# EAGLE board RF08ind (EAGLE 6.6.0), part 1 of 3
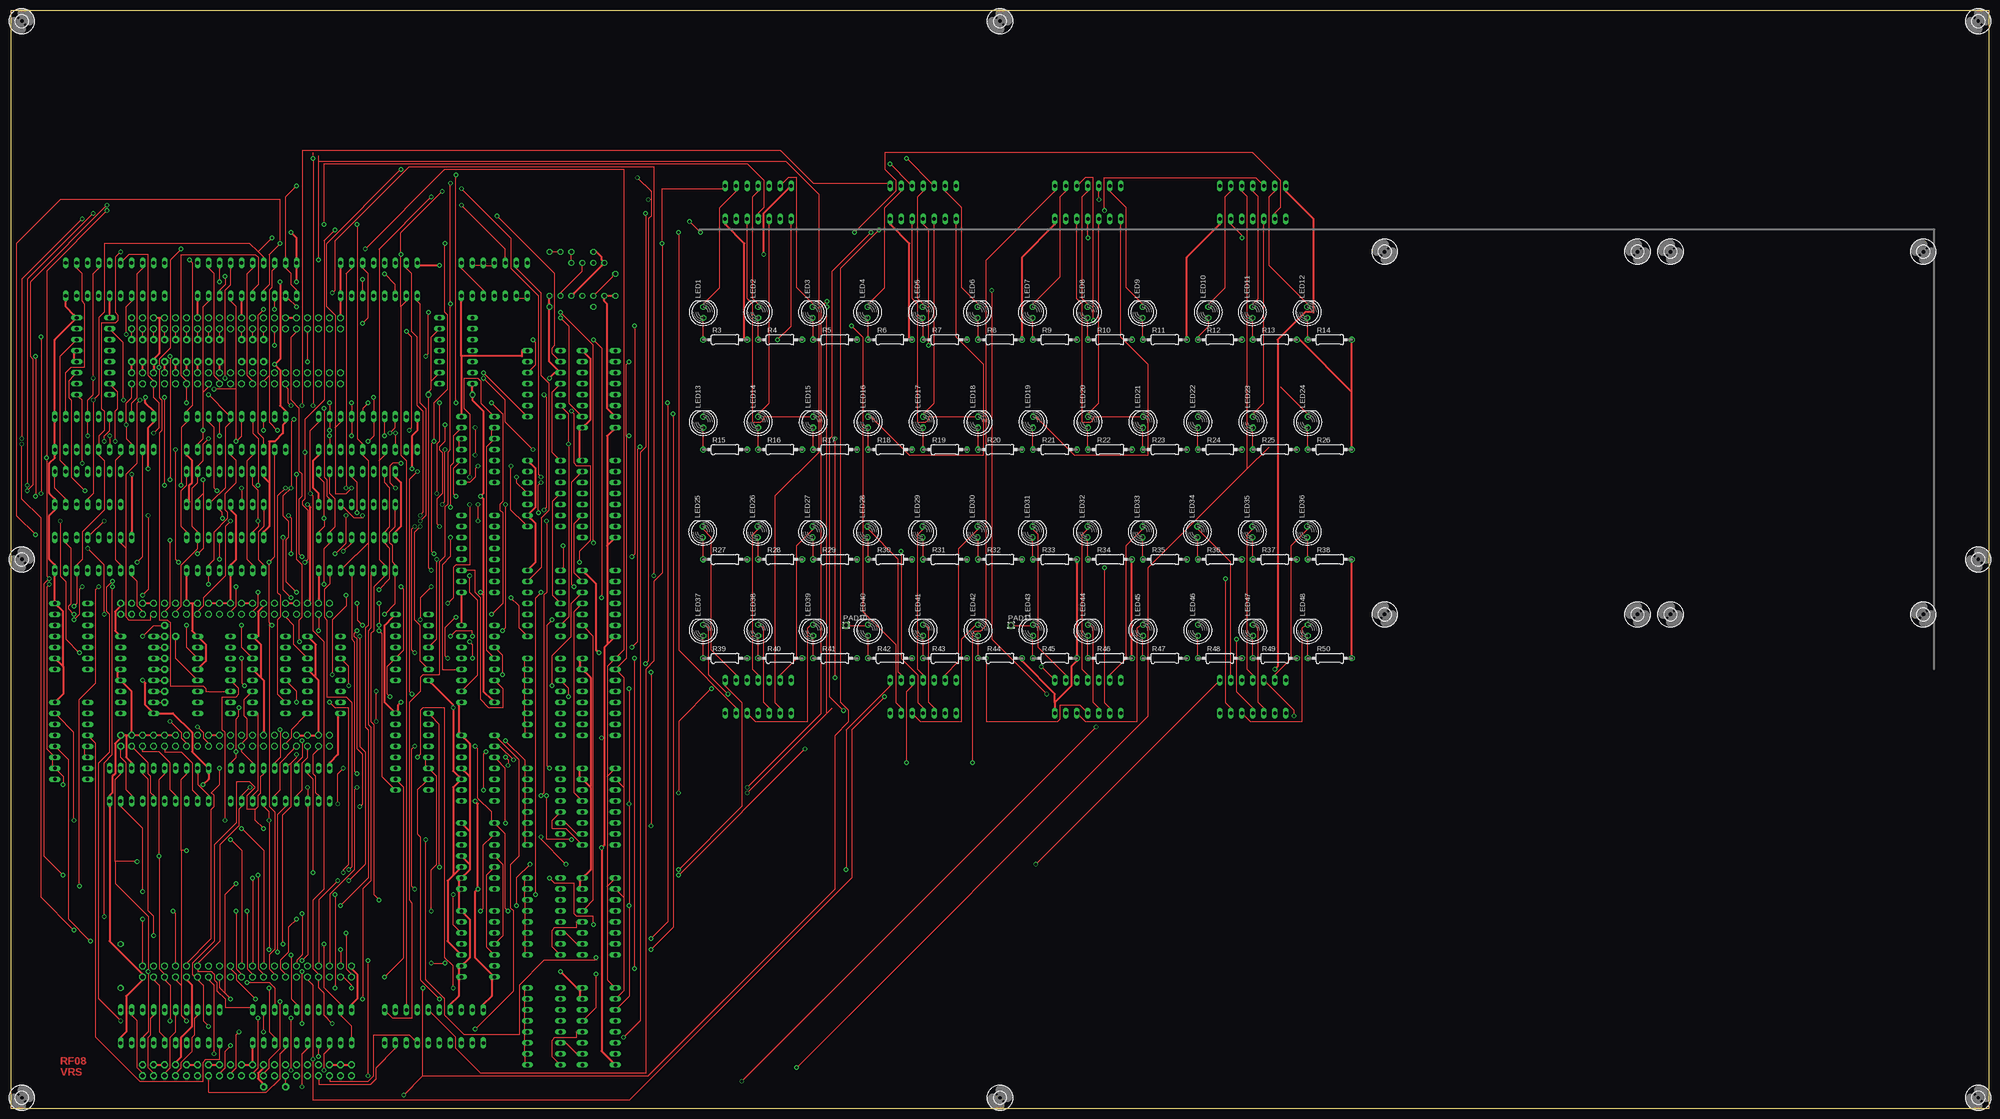
[diagram p4: board, top side]
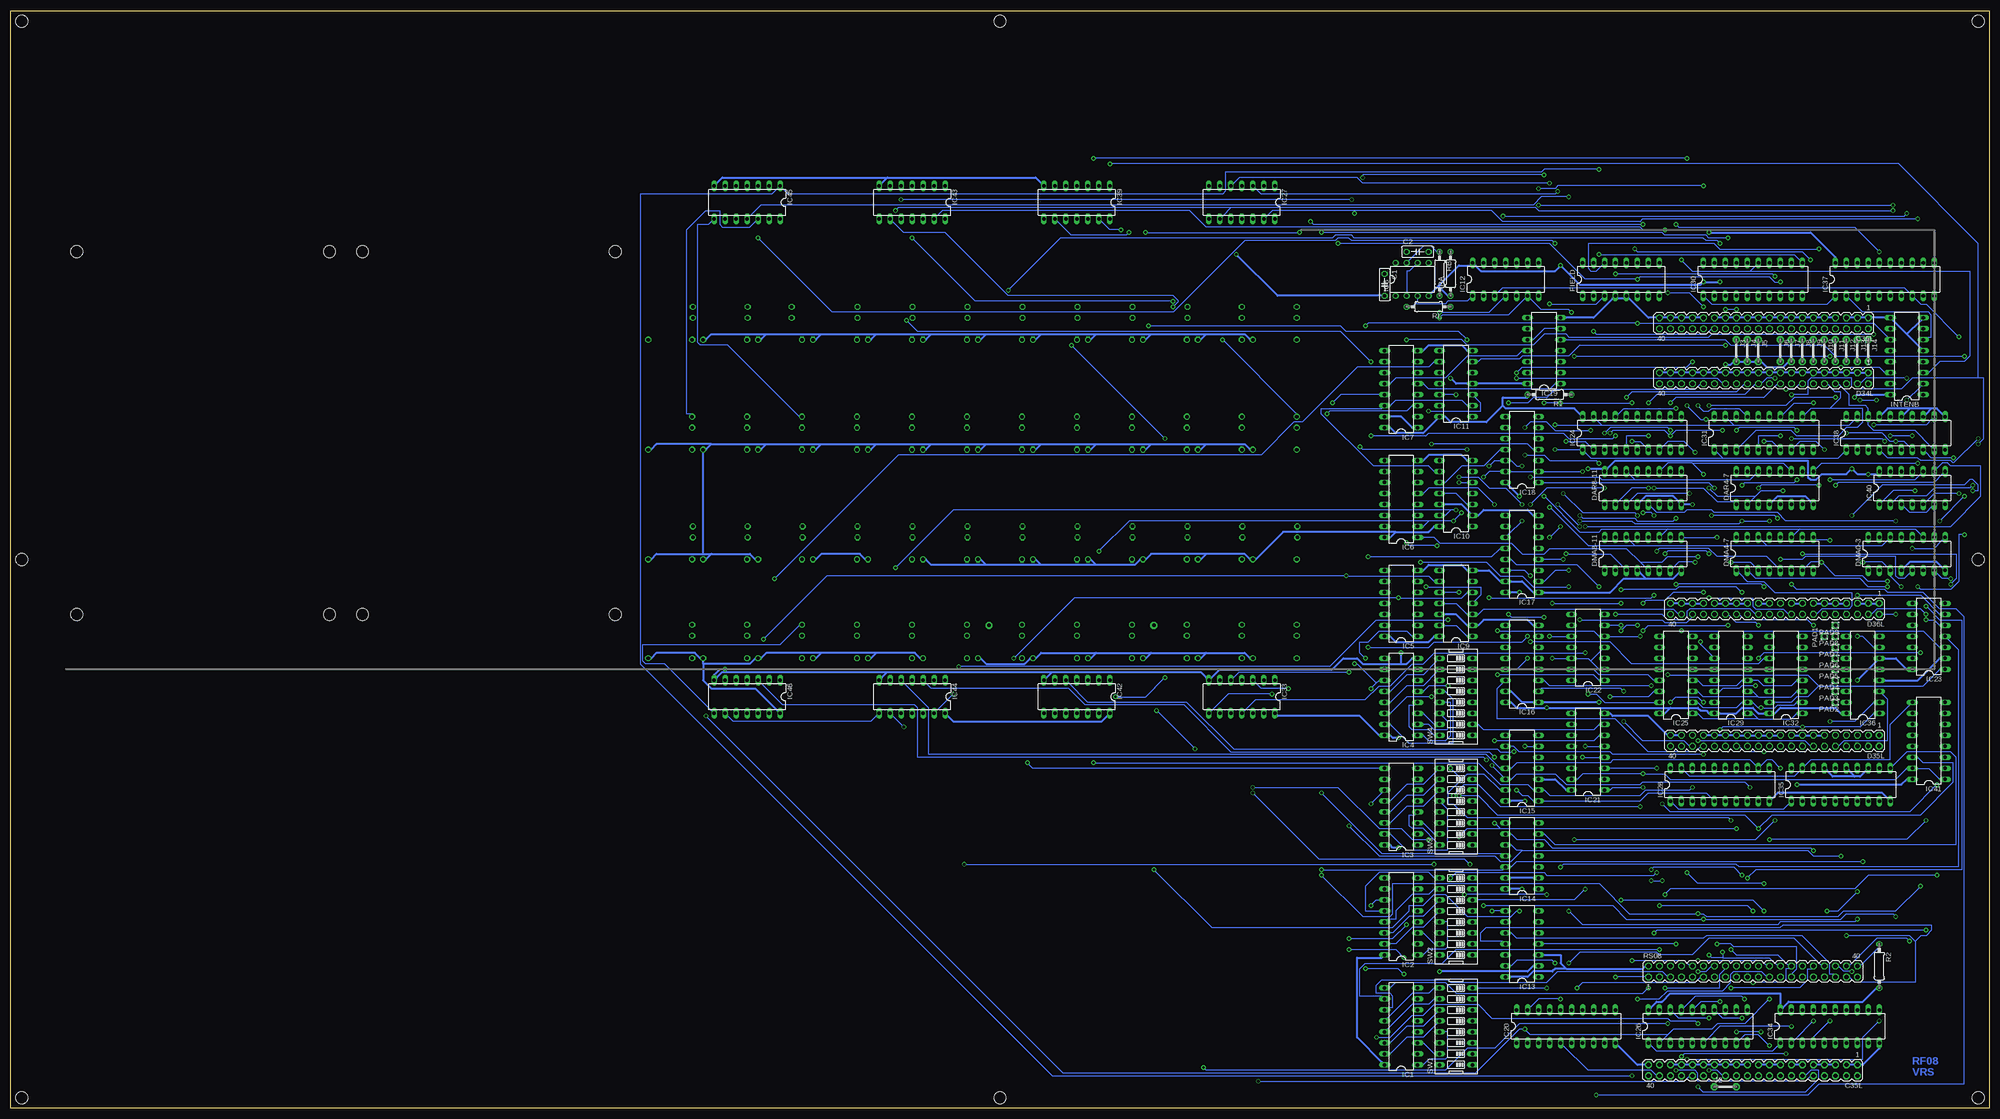
[diagram p5: board, bottom side, seen from below]

Size 457.18 x 253.67 mm. Coordinates in mm from the lower left corner, seen from the top.
Outline: 0,0 457.18,0 457.18,253.67 0,253.67 0,0
Copper layers (1*16): Top 0.035mm / dielectric 1.5mm / Bottom 0.035mm
Design rules "default": minimum track width 10mil, minimum drill 24mil, track to track 8mil, track to pad 8mil, pad to pad 8mil, via to via 8mil, smd to smd 8mil, copper to edge 40mil, drill to drill 8mil, minimum pad ring 10mil, minimum via ring 8mil, stop-mask expansion 4mil, vias tented up to drill 0mil, thermal gap 10mil
Net classes: 1 Power: width 0.508 mm

## Footprints (pad centres in the part's own frame; a part is rotated, then mirrored left to right if it is on the bottom)
C050-025X075 = drill 0.813 octagon: 1 -2.54,0; 2 2.54,0
MA20-2 = drill 1.016 octagon: 1 -24.13,-1.27; 2 -24.13,1.27; 3 -21.59,-1.27; 4 -21.59,1.27; 5 -19.05,-1.27; 6 -19.05,1.27; 7 -16.51,-1.27; 8 -16.51,1.27; 9 -13.97,-1.27; 10 -13.97,1.27; 11 -11.43,-1.27; 12 -11.43,1.27; 13 -8.89,-1.27; 14 -8.89,1.27; 15 -6.35,-1.27; 16 -6.35,1.27; 17 -3.81,-1.27; 18 -3.81,1.27; 19 -1.27,-1.27; 20 -1.27,1.27; 21 1.27,-1.27; 22 1.27,1.27; 23 3.81,-1.27; 24 3.81,1.27; 25 6.35,-1.27; 26 6.35,1.27; 27 8.89,-1.27; 28 8.89,1.27; 29 11.43,-1.27; 30 11.43,1.27; 31 13.97,-1.27; 32 13.97,1.27; 33 16.51,-1.27; 34 16.51,1.27; 35 19.05,-1.27; 36 19.05,1.27; 37 21.59,-1.27; 38 21.59,1.27; 39 24.13,-1.27; 40 24.13,1.27
DIL16 = drill 0.813 long: 1 -8.89,-3.81; 2 -6.35,-3.81; 3 -3.81,-3.81; 4 -1.27,-3.81; 5 1.27,-3.81; 6 3.81,-3.81; 7 6.35,-3.81; 8 8.89,-3.81; 9 8.89,3.81; 10 6.35,3.81; 11 3.81,3.81; 12 1.27,3.81; 13 -1.27,3.81; 14 -3.81,3.81; 15 -6.35,3.81; 16 -8.89,3.81
DIL14 = drill 0.813 long: 1 -7.62,-3.81; 2 -5.08,-3.81; 3 -2.54,-3.81; 4 0,-3.81; 5 2.54,-3.81; 6 5.08,-3.81; 7 7.62,-3.81; 8 7.62,3.81; 9 5.08,3.81; 10 2.54,3.81; 11 0,3.81; 12 -2.54,3.81; 13 -5.08,3.81; 14 -7.62,3.81
DIL08 = drill 0.813 pad 1.27: 1 -3.81,-3.81; 2 -1.27,-3.81; 3 1.27,-3.81; 4 3.81,-3.81; 5 3.81,3.81; 6 1.27,3.81; 7 -1.27,3.81; 8 -3.81,3.81
DIL20 = drill 0.813 long: 1 -11.43,-3.81; 2 -8.89,-3.81; 3 -6.35,-3.81; 4 -3.81,-3.81; 5 -1.27,-3.81; 6 1.27,-3.81; 7 3.81,-3.81; 8 6.35,-3.81; 9 8.89,-3.81; 10 11.43,-3.81; 11 11.43,3.81; 12 8.89,3.81; 13 6.35,3.81; 14 3.81,3.81; 15 1.27,3.81; 16 -1.27,3.81; 17 -3.81,3.81; 18 -6.35,3.81; 19 -8.89,3.81; 20 -11.43,3.81
05 = drill 0.813 pad 1.6 octagon: 1 -2.54,0; 2 2.54,0
LED5MM = drill 0.813 octagon: A -1.27,0; K 1.27,0
1,6/0,8 = drill 0.813 pad 1.6 octagon: 1 0,0
0207/10 = drill 0.813 octagon: 1 -5.08,0; 2 5.08,0
EDG-08 = drill 0.813 long: 1 -8.89,-3.81; 2 -6.35,-3.81; 3 -3.81,-3.81; 4 -1.27,-3.81; 5 1.27,-3.81; 6 3.81,-3.81; 7 6.35,-3.81; 8 8.89,-3.81; 9 8.89,3.81; 10 6.35,3.81; 11 3.81,3.81; 12 1.27,3.81; 13 -1.27,3.81; 14 -3.81,3.81; 15 -6.35,3.81; 16 -8.89,3.81
2,8 = hole 2.8: 0,0

## Placement (x,y rotation side)
C1  .1uf  [C050-025X075]  139.69,190.34 270 bottom
C2  .1uf  [C050-025X075]  132.08,197.96 0 bottom
C35L  [MA20-2]  54.6,8.73 180 bottom
C36L  [MA20-2]  52.06,181.45 180 bottom
D34L  [MA20-2]  52.06,168.75 180 bottom
D35L  [MA20-2]  49.52,84.92 180 bottom
D36L  [MA20-2]  49.52,115.4 180 bottom
DAR4-7  74LS193N  [DIL16]  49.52,143.34 0 bottom
DAR8-11  74LS193N  [DIL16]  80.01,143.34 0 bottom
DMA0-3  74LS193N  [DIL16]  19.05,128.11 0 bottom
DMA4-7  74LS193N  [DIL16]  49.52,128.11 0 bottom
DMA8-11  74LS193N  [DIL16]  80.01,128.11 0 bottom
FIELD  74LS193N  [DIL16]  85.09,191.61 0 bottom
IC1  74LS151N  [DIL16]  135.88,18.89 90 bottom
IC2  74LS151N  [DIL16]  135.88,44.29 90 bottom
IC3  74LS151N  [DIL16]  135.88,69.68 90 bottom
IC4  74LS151N  [DIL16]  135.88,95.08 90 bottom
IC5  74LS20N  [DIL14]  135.88,116.67 90 bottom
IC6  74S139N  [DIL16]  135.88,140.81 90 bottom
IC7  74LS139N  [DIL16]  135.88,166.21 90 bottom
IC8  LM555N  [DIL08]  133.34,191.61 0 bottom
IC9  74S74N  [DIL14]  123.19,116.67 90 bottom
IC10  74S74N  [DIL14]  123.19,142.08 90 bottom
IC11  74S74N  [DIL14]  123.19,167.47 90 bottom
IC12  74LS00N  [DIL14]  111.76,191.61 0 bottom
IC13  74180N  [DIL14]  107.95,37.94 90 bottom
IC14  74180N  [DIL14]  107.95,58.26 90 bottom
IC15  74180N  [DIL14]  107.95,78.57 90 bottom
IC16  74S139N  [DIL16]  107.95,102.7 90 bottom
IC17  74S139N  [DIL16]  107.95,128.11 90 bottom
IC18  74LS00N  [DIL14]  107.95,152.24 90 bottom
IC19  7407N  [DIL14]  102.87,175.09 90 bottom
IC20  74S240N  [DIL20]  97.79,18.89 0 bottom
IC21  74LS139N  [DIL16]  92.7,82.38 90 bottom
IC22  7407N  [DIL14]  92.7,106.52 90 bottom
IC23  74S74N  [DIL14]  13.96,109.05 90 bottom
IC24  74S240N  [DIL20]  82.55,156.05 0 bottom
IC25  74S138N  [DIL16]  72.39,100.16 90 bottom
IC26  74S240N  [DIL20]  67.31,18.89 0 bottom
IC27  7404N  [DIL14]  172.72,209.39 180 bottom
IC28  74LS244N  [DIL20]  62.22,74.77 0 bottom
IC29  74S138N  [DIL16]  59.68,100.16 90 bottom
IC30  74S240N  [DIL20]  54.6,191.61 0 bottom
IC31  74S240N  [DIL20]  52.06,156.05 0 bottom
IC32  74S138N  [DIL16]  46.98,100.16 90 bottom
IC33  7404N  [DIL14]  172.72,95.08 180 bottom
IC34  74S240N  [DIL20]  36.82,18.89 0 bottom
IC35  74LS244N  [DIL20]  34.28,74.77 0 bottom
IC36  74S138N  [DIL16]  29.21,100.16 90 bottom
IC37  74S240N  [DIL20]  24.12,191.61 0 bottom
IC38  74S240N  [DIL20]  21.59,156.05 0 bottom
IC39  7404N  [DIL14]  210.81,209.39 180 bottom
IC40  74S03N  [DIL14]  17.78,143.34 0 bottom
IC41  74LS139N  [DIL16]  13.96,84.92 90 bottom
IC42  7404N  [DIL14]  210.81,95.08 180 bottom
IC43  7404N  [DIL14]  248.91,209.39 180 bottom
IC44  7404N  [DIL14]  248.91,95.08 180 bottom
IC45  7404N  [DIL14]  287.01,209.39 180 bottom
IC46  7404N  [DIL14]  287.01,95.08 180 bottom
INTENB  74LS193N  [DIL16]  19.05,173.83 90 bottom
J2  J5MM  [05]  60.95,4.92 0 bottom
J3  J5MM  [05]  58.41,175.09 270 bottom
J4  J5MM  [05]  55.88,175.09 270 bottom
J5  J5MM  [05]  53.34,175.09 270 bottom
J6  J5MM  [05]  48.25,175.09 270 bottom
J7  J5MM  [05]  45.71,175.09 270 bottom
J8  J5MM  [05]  43.17,175.09 270 bottom
J9  J5MM  [05]  40.63,175.09 270 bottom
J10  J5MM  [05]  38.09,175.09 270 bottom
J11  J5MM  [05]  35.55,175.09 270 bottom
J12  J5MM  [05]  33.02,175.09 270 bottom
J13  J5MM  [05]  30.48,175.09 270 bottom
J14  J5MM  [05]  27.94,175.09 270 bottom
LED1  [LED5MM]  160.02,183.99 90 top
LED2  [LED5MM]  172.72,183.99 90 top
LED3  [LED5MM]  185.29,183.99 90 top
LED4  [LED5MM]  197.99,183.99 90 top
LED5  [LED5MM]  210.69,183.99 90 top
LED6  [LED5MM]  223.39,183.99 90 top
LED7  [LED5MM]  236.09,183.99 90 top
LED8  [LED5MM]  248.79,183.99 90 top
LED9  [LED5MM]  261.49,183.99 90 top
LED10  [LED5MM]  276.73,183.99 90 top
LED11  [LED5MM]  286.89,183.99 90 top
LED12  [LED5MM]  299.59,183.99 90 top
LED13  [LED5MM]  160.02,158.59 90 top
LED14  [LED5MM]  172.72,158.59 90 top
LED15  [LED5MM]  185.41,158.59 90 top
LED16  [LED5MM]  198.12,158.59 90 top
LED17  [LED5MM]  210.81,158.59 90 top
LED18  [LED5MM]  223.52,158.59 90 top
LED19  [LED5MM]  236.22,158.59 90 top
LED20  [LED5MM]  248.91,158.59 90 top
LED21  [LED5MM]  261.62,158.59 90 top
LED22  [LED5MM]  274.31,158.59 90 top
LED23  [LED5MM]  287.01,158.59 90 top
LED24  [LED5MM]  299.72,158.59 90 top
LED25  [LED5MM]  159.89,133.19 90 top
LED26  [LED5MM]  172.59,133.19 90 top
LED27  [LED5MM]  185.29,133.19 90 top
LED28  [LED5MM]  197.99,133.19 90 top
LED29  [LED5MM]  210.69,133.19 90 top
LED30  [LED5MM]  223.39,133.19 90 top
LED31  [LED5MM]  236.09,133.19 90 top
LED32  [LED5MM]  248.79,133.19 90 top
LED33  [LED5MM]  261.49,133.19 90 top
LED34  [LED5MM]  274.19,133.19 90 top
LED35  [LED5MM]  286.89,133.19 90 top
LED36  [LED5MM]  299.59,133.19 90 top
LED37  [LED5MM]  160.02,110.45 90 top
LED38  [LED5MM]  172.72,110.45 90 top
LED39  [LED5MM]  185.41,110.45 90 top
LED40  [LED5MM]  198.12,110.45 90 top
LED41  [LED5MM]  210.81,110.45 90 top
LED42  [LED5MM]  223.52,110.45 90 top
LED43  [LED5MM]  236.22,110.45 90 top
LED44  [LED5MM]  248.91,110.45 90 top
LED45  [LED5MM]  261.62,110.45 90 top
LED46  [LED5MM]  274.31,110.45 90 top
LED47  [LED5MM]  287.01,110.45 90 top
LED48  [LED5MM]  299.72,110.45 90 top
PAD1  [1,6/0,8]  38.09,109.05 180 bottom
PAD2  [1,6/0,8]  35.55,93.81 180 bottom
PAD3  [1,6/0,8]  35.55,96.35 180 bottom
PAD4  [1,6/0,8]  35.55,98.89 180 bottom
PAD5  [1,6/0,8]  35.55,101.43 180 bottom
PAD6  [1,6/0,8]  35.55,103.97 180 bottom
PAD7  [1,6/0,8]  35.55,106.52 180 bottom
PAD8  [1,6/0,8]  35.55,109.05 180 bottom
PAD9  [1,6/0,8]  35.55,111.59 180 bottom
PAD10  [1,6/0,8]  193.03,111.59 0 top
PAD11  [1,6/0,8]  231.13,111.59 0 top
R1  5.1K  [0207/10]  101.59,164.94 180 bottom
R2  5.1K  [0207/10]  25.39,32.86 270 bottom
R3  330  [0207/10]  165.09,177.64 0 top
R4  330  [0207/10]  177.8,177.64 0 top
R5  330  [0207/10]  190.5,177.64 0 top
R6  330  [0207/10]  203.19,177.64 0 top
R7  330  [0207/10]  215.9,177.64 0 top
R8  330  [0207/10]  228.59,177.64 0 top
R9  330  [0207/10]  241.3,177.64 0 top
R10  330  [0207/10]  254,177.64 0 top
R11  330  [0207/10]  266.69,177.64 0 top
R12  330  [0207/10]  279.39,177.64 0 top
R13  330  [0207/10]  292.1,177.64 0 top
R14  330  [0207/10]  304.8,177.64 0 top
R15  330  [0207/10]  165.09,152.24 0 top
R16  330  [0207/10]  177.8,152.24 0 top
R17  330  [0207/10]  190.5,152.24 0 top
R18  330  [0207/10]  203.19,152.24 0 top
R19  330  [0207/10]  215.9,152.24 0 top
R20  330  [0207/10]  228.59,152.24 0 top
R21  330  [0207/10]  241.3,152.24 0 top
R22  330  [0207/10]  254,152.24 0 top
R23  330  [0207/10]  266.69,152.24 0 top
R24  330  [0207/10]  279.39,152.24 0 top
R25  330  [0207/10]  292.1,152.24 0 top
R26  330  [0207/10]  304.8,152.24 0 top
R27  330  [0207/10]  165.09,126.83 0 top
R28  330  [0207/10]  177.8,126.83 0 top
R29  330  [0207/10]  190.5,126.83 0 top
R30  330  [0207/10]  203.19,126.83 0 top
R31  330  [0207/10]  215.9,126.83 0 top
R32  330  [0207/10]  228.59,126.83 0 top
R33  330  [0207/10]  241.3,126.83 0 top
R34  330  [0207/10]  254,126.83 0 top
R35  330  [0207/10]  266.69,126.83 0 top
R36  330  [0207/10]  279.39,126.83 0 top
R37  330  [0207/10]  292.1,126.83 0 top
R38  330  [0207/10]  304.8,126.83 0 top
R39  330  [0207/10]  165.09,103.97 0 top
R40  330  [0207/10]  177.8,103.97 0 top
R41  330  [0207/10]  190.5,103.97 0 top
R42  330  [0207/10]  203.19,103.97 0 top
R43  330  [0207/10]  215.9,103.97 0 top
R44  330  [0207/10]  228.59,103.97 0 top
R45  330  [0207/10]  241.3,103.97 0 top
R46  330  [0207/10]  254,103.97 0 top
R47  330  [0207/10]  266.69,103.97 0 top
R48  330  [0207/10]  279.39,103.97 0 top
R49  330  [0207/10]  292.1,103.97 0 top
R50  330  [0207/10]  304.8,103.97 0 top
RA  470K  [0207/10]  124.45,192.88 90 bottom
RB  1.5K  [0207/10]  127,192.88 270 bottom
RL  1K  [0207/10]  129.53,185.25 180 bottom
RS08  [MA20-2]  54.6,31.59 0 bottom
SW1  [EDG-08]  123.19,18.89 90 bottom
SW2  [EDG-08]  123.19,44.29 90 bottom
SW3  [EDG-08]  123.19,69.68 90 bottom
SW4  [EDG-08]  123.19,95.08 90 bottom
U$1  [2,8]  2.54,126.83 0 top
U$2  [2,8]  228.59,251.3 0 top
U$3  [2,8]  2.54,2.38 0 top
U$4  [2,8]  228.59,2.38 0 top
U$5  [2,8]  2.54,251.3 0 top
U$6  [2,8]  454.66,2.38 0 top
U$7  [2,8]  454.66,126.83 0 top
U$8  [2,8]  454.66,251.3 0 top
U$9  [2,8]  317.5,197.96 90 top
U$10  [2,8]  317.5,114.13 90 top
U$11  [2,8]  375.92,197.96 90 top
U$12  [2,8]  375.92,114.13 90 top
U$13  [2,8]  383.54,197.96 90 top
U$14  [2,8]  383.54,114.13 90 top
U$15  [2,8]  441.95,197.96 90 top
U$16  [2,8]  441.95,114.13 90 top

## Tracks (layer width: path | path; a pad name or v marks a point on that pad's centre or on a via)
!3CYC
  Top 0.254: C35L.28 63.49,6.82 63.49,5.55 J2.1
!601  (via drill 0.61)
  Top 0.254: IC18.4 103.5,152.87 103.5,154.14 IC18.5 | IC11.13 127.63,161.76 128.9,160.49 v128.9,153.5 128.9,113.5 127.63,112.23 IC9.13 | v74.29,100.16 74.29,112.86 77.47,116.04 v77.47,118.58 | v115.56,117.94 117.47,116.04 117.47,110.96 118.74,109.69 IC9.1
  Bottom 0.254: 39.36,97.62 15.23,97.62 11.42,101.43 IC23.1 | 39.36,97.62 41.9,95.08 44.45,95.08 45.71,93.81 49.52,93.81 IC32.15 | IC9.1 120.65,109.05 123.19,111.59 125.73,111.59 IC9.13 | v128.9,153.5 106.68,153.5 105.41,152.24 IC18.4 | 39.36,97.62 41.9,100.16 v74.29,100.16 | v77.47,118.58 78.1,117.94 v115.56,117.94
!602  (via drill 0.61)
  Top 0.254: v63.49,143.34 61.59,141.44 61.59,119.21 62.22,118.58 62.22,113.5 61.59,112.86 61.59,95.72 62.86,94.45 IC29.15 | v107.95,148.43 107.31,147.79 107.31,145.89 106.04,144.62 105.41,144.62 IC18.1 | v115.56,148.43 115.56,138.27 118.74,135.09 IC10.1
  Bottom 0.254: v63.49,143.34 64.77,144.62 102.87,144.62 IC18.1 | v107.95,148.43 109.22,148.43 110.48,149.7 IC18.12 113.03,149.7 114.3,149.7 v115.56,148.43
!604  (via drill 0.61)
  Top 0.254: v92.7,95.72 92.07,96.35 92.07,145.25 v93.98,147.16 | v116.84,145.89 116.84,144.62 118.74,142.71 IC10.4
  Bottom 0.254: v92.7,95.72 90.8,95.72 88.9,93.81 77.47,93.81 IC25.15 | v93.98,147.16 102.87,147.16 IC18.2 105.41,147.16 110.48,147.16 IC18.13 113.03,147.16 115.56,147.16 v116.84,145.89
!611  (via drill 0.61)
  Top 0.254: IC32.14 49.52,96.35 45.08,96.35 45.08,96.99 44.45,97.62 36.82,97.62 36.82,112.23 36.19,112.86 34.28,112.86 34.28,156.05 34.92,156.68 34.92,163.67 34.28,164.3 v34.28,171.28 34.28,173.19 36.82,175.73 36.82,196.05 v39.36,198.59
  Bottom 0.254: v34.28,171.28 25.39,171.28 24.12,170.02 INTENB.14 | v39.36,198.59 62.22,198.59 63.49,199.86 92.7,199.86 92.7,194.15 92.07,193.51 90.8,193.51 89.53,194.78 FIELD.14
!612  (via drill 0.61)
  Top 0.254: v53.97,97.62 53.34,98.26 v53.34,103.97 | v15.87,105.24 12.69,108.42 12.69,121.75 11.42,123.02 v11.42,135.72 | v5.71,173.83 v5.71,141.44
  Bottom 0.254: v53.97,97.62 57.14,97.62 57.78,96.99 61.59,96.99 62.22,96.35 IC29.14 | v53.34,103.97 52.06,105.24 v15.87,105.24 | v5.71,141.44 v11.42,135.72 | v5.71,173.83 35.55,173.83 38.09,176.37 59.68,176.37 60.95,177.64 97.79,177.64 IC19.5
!614  (via drill 0.61)
  Top 0.254: v87.62,95.08 86.99,95.72 86.99,102.07 88.26,103.34 IC22.3 89.53,104.61 90.8,105.88 90.8,119.85 v90.17,120.48
  Bottom 0.254: v87.62,95.08 78.73,95.08 77.47,96.35 IC25.14 | v90.17,120.48 95.25,125.56 109.22,125.56 110.48,126.83 IC17.13
!621  (via drill 0.61)
  Top 0.254: v49.52,66.51 49.52,86.83 48.89,87.46 48.89,95.08 52.06,95.08 52.7,95.72 52.7,96.99 51.43,98.26 IC32.13 | v95.88,62.06 95.88,29.68 100.33,25.23 100.33,21.43 104.77,16.98 117.47,16.98 117.47,28.41 123.19,34.12 135.25,34.12 v135.25,34.76 | v147.95,36.66 153.03,41.74 v153.03,160.49
  Bottom 0.254: v49.52,66.51 53.97,62.06 v95.88,62.06 | v135.25,34.76 137.16,36.66 v147.95,36.66 | v153.03,160.49 152.4,161.12 134.62,161.12 133.34,162.4 IC7.3
!622  (via drill 0.61)
  Top 0.254: v66.04,93.81 66.04,96.35 64.13,98.26 IC29.13 | v73.66,93.81 74.93,92.54 78.1,92.54 78.1,56.35 76.83,55.08 v76.83,54.45 | v124.45,53.18 125.73,51.91 130.17,51.91 130.17,44.92 130.81,44.29 134.62,44.29 v134.62,42.38 | v147.95,39.2 151.76,43.02 v151.76,163.03
  Bottom 0.254: v66.04,93.81 67.31,95.08 72.39,95.08 v73.66,93.81 | v76.83,54.45 77.47,53.81 102.23,53.81 102.87,54.45 123.19,54.45 v124.45,53.18 | v134.62,42.38 137.79,39.2 v147.95,39.2 | v151.76,163.03 149.86,164.94 140.97,164.94 IC7.13
!624  (via drill 0.61)
  Top 0.254: v94.61,134.46 93.34,133.19 93.34,112.86 94.61,111.59 94.61,103.34 95.88,102.07 IC22.13 | v99.69,139.53 100.33,140.17 v100.33,152.24
  Bottom 0.254: IC25.13 77.47,98.89 78.73,100.16 90.17,100.16 91.44,101.43 95.25,101.43 IC22.13 | 61.59,150.33 34.92,150.33 33.65,151.6 IC38.1 | 61.59,150.33 62.86,151.6 IC31.1 | 61.59,150.33 92.07,150.33 93.34,151.6 IC24.1 94.61,152.24 v100.33,152.24 | v94.61,134.46 v99.69,139.53
!641  (via drill 0.61)
  Top 0.254: v106.04,107.78 106.68,107.15 v106.68,103.97
  Bottom 0.254: v106.04,107.78 87.62,107.78 82.55,102.7 53.34,102.7 52.06,103.97 IC32.11 | v106.68,103.97 109.22,101.43 110.48,101.43 IC16.13
!642  (via drill 0.61)
  Top 0.254: v66.67,107.78 66.67,112.86 67.31,113.5 67.31,125.56 66.04,126.83 v66.04,146.52
  Bottom 0.254: v66.67,107.78 66.67,107.15 64.13,104.61 IC29.11 | v66.04,146.52 68.58,149.06 | 68.58,149.06 74.29,149.06 75.56,147.79 DAR8-11.11 | 68.58,149.06 47.62,149.06 46.35,147.79 DAR4-7.11
!644  (via drill 0.61)
  Top 0.254: v78.1,97.62 78.1,102.07 76.83,103.34 IC25.11
  Bottom 0.254: v78.1,97.62 101.59,97.62 102.87,98.89 IC16.3
!645  (via drill 0.61)
  Top 0.254: v101.59,131.92 101.59,127.47 99.69,125.56 99.69,101.43 102.87,101.43 IC16.4 | v99.06,134.46 98.42,135.09 98.42,140.81 99.69,142.08 99.69,151.6 99.06,152.24 99.06,152.87 100.33,154.14 v100.33,157.95
  Bottom 0.254: 59.05,157.95 32.38,157.95 31.11,159.22 IC38.19 | 59.05,157.95 60.32,159.22 IC31.19 | 89.53,157.95 90.8,159.22 IC24.19 | 89.53,157.95 59.05,157.95 | v99.06,134.46 v101.59,131.92 | v100.33,157.95 89.53,157.95
!ACB00  (via drill 0.61)
  Top 0.254: IC38.3 27.94,153.5 26.67,154.78 v26.67,157.95 26.67,163.03 27.94,164.3 27.94,166.84 D34L.2 | IC38.12 12.69,161.12 12.69,170.02 13.96,171.28 17.14,171.28 17.14,185.89 16.51,186.53 16.51,192.88 15.23,194.15 IC37.12
  Bottom 0.254: v26.67,157.95 14.6,157.95 13.33,159.22 IC38.12
!ACB01  (via drill 0.61)
  Top 0.254: v22.86,155.41 22.86,153.5 IC38.5 | v17.78,155.41 17.78,158.59 IC38.14 17.78,161.12 17.78,163.67 19.05,164.94 v19.05,168.75 19.05,192.88 20.32,194.15 IC37.14
  Bottom 0.254: v17.78,155.41 v22.86,155.41 | v19.05,168.75 28.57,168.75 29.84,167.47 D34L.4
!ACB02  (via drill 0.61)
  Top 0.254: v21.59,154.14 21.59,155.41 22.86,156.68 22.86,158.59 IC38.16 | IC37.16 26.03,196.05 27.3,197.32 31.75,197.32 31.75,169.38 33.02,168.11 D34L.6 33.02,166.84 33.02,164.3 34.28,163.03 34.28,157.31 v33.02,156.05
  Bottom 0.254: IC38.7 18.41,152.87 19.68,154.14 v21.59,154.14 22.86,154.14 24.76,156.05 v33.02,156.05
!ACB03
  Top 0.254: IC37.18 30.48,194.15 29.21,192.88 29.21,164.3 27.94,163.03 27.94,161.12 IC38.18
  Bottom 0.254: IC38.9 13.33,152.87 17.14,156.68 26.67,156.68 27.94,157.95 27.94,158.59 IC38.18 27.94,161.12 27.94,161.76 28.57,162.4 32.38,162.4 32.38,164.94 34.92,167.47 D34L.8
!ACB04  (via drill 0.61)
  Top 0.254: v60.95,184.62 60.95,186.53 IC30.3 | v58.41,184.62 57.14,183.35 57.14,156.05 58.41,154.78 58.41,153.5 IC31.3
  Bottom 0.254: 36.82,161.76 41.27,161.76 42.54,160.49 IC31.12 | 36.82,161.76 34.28,164.3 34.28,165.57 35.55,165.57 37.46,167.47 D34L.10 | 36.82,161.76 29.21,161.76 29.21,158.59 30.48,157.31 33.02,157.31 34.92,155.41 44.45,155.41 45.71,156.68 53.97,156.68 57.78,152.87 IC31.3 | v58.41,184.62 v60.95,184.62
!ACB05  (via drill 0.61)
  Top 0.254: v40.63,163.03 40.63,166.84 D34L.12 40.63,168.11 39.36,169.38 39.36,197.32 56.51,197.32 57.14,196.69 57.14,190.34 55.88,189.06 IC30.5 | v48.25,155.41 48.25,158.59 IC31.14
  Bottom 0.254: v40.63,163.03 45.08,163.03 47.62,160.49 IC31.14 | v48.25,155.41 53.34,155.41 53.34,153.5 IC31.5
!ACB06  (via drill 0.61)
  Top 0.254: IC31.16 53.34,158.59 53.34,155.41 v52.06,154.14 52.06,166.21 | 52.06,166.21 52.06,185.25 50.79,186.53 IC30.7 | 52.06,166.21 v46.98,166.21
  Bottom 0.254: v52.06,154.14 50.16,154.14 48.89,152.87 IC31.7 | v46.98,166.21 45.08,166.21 43.81,167.47 D34L.14
!ACB07  (via drill 0.61)
  Top 0.254: 44.45,165.57 v44.45,156.68 44.45,154.78 43.17,153.5 IC31.9 | 44.45,165.57 45.71,166.84 D34L.16 | 44.45,165.57 44.45,185.25 45.71,186.53 IC30.9 | v58.41,156.68 58.41,158.59 IC31.18
  Bottom 0.254: v58.41,156.68 57.78,157.31 45.08,157.31 v44.45,156.68
!ACB08  (via drill 0.61)
  Top 0.254: IC30.12 45.71,194.15 46.98,192.88 46.98,169.38 48.25,168.11 D34L.18 | v73.66,163.03 73.66,161.12 IC24.12 73.66,158.59 v73.66,156.68 | v88.9,156.05 88.9,153.5 IC24.3
  Bottom 0.254: v73.66,163.03 72.39,164.3 52.06,164.3 48.89,167.47 D34L.18 | v88.9,156.05 87.62,157.31 74.29,157.31 v73.66,156.68
!ACB09  (via drill 0.61)
  Top 0.254: v78.73,155.41 78.73,158.59 IC24.14 78.73,161.12 v78.73,163.03 | v49.52,168.75 49.52,189.06 50.79,190.34 50.79,194.15 IC30.14
  Bottom 0.254: v78.73,155.41 83.81,155.41 83.81,153.5 IC24.5 | v49.52,168.75 51.43,168.75 52.7,167.47 D34L.22 53.97,167.47 56.51,164.94 76.83,164.94 v78.73,163.03
!ACB10  (via drill 0.61)
  Top 0.254: v82.55,154.14 83.81,155.41 83.81,158.59 IC24.16 83.81,161.12 v83.81,164.3 | IC30.16 55.88,194.15 54.6,192.88 54.6,169.38 55.88,168.11 D34L.24
  Bottom 0.254: v82.55,154.14 80.64,154.14 79.37,152.87 IC24.7 | v83.81,164.3 82.55,165.57 58.41,165.57 56.51,167.47 D34L.24
!ACB11  (via drill 0.61)
  Top 0.254: v73.66,155.41 73.66,153.5 IC24.9 | v87.62,156.05 88.9,157.31 88.9,158.59 IC24.18 | 59.68,169.38 59.68,189.06 60.32,189.7 60.32,193.51 60.95,194.15 IC30.18 | 59.68,169.38 58.41,168.11 D34L.26 | v61.59,156.68 59.68,158.59 59.68,169.38
  Bottom 0.254: v87.62,156.05 86.99,156.68 74.93,156.68 v73.66,155.41 72.39,156.68 v61.59,156.68
!ACCLEAR  (via drill 0.61)
  Top 0.254: v111.12,163.03 113.66,160.49 113.66,140.17 113.03,139.53 113.03,138.27 113.66,137.63 113.66,116.67 v111.12,114.13 | v102.87,113.5 100.33,110.96 100.33,104.61 v100.96,103.97
  Bottom 0.254: 92.07,103.34 92.7,103.97 95.25,103.97 IC22.12 97.79,103.97 v100.96,103.97 | 92.07,103.34 90.17,101.43 IC22.2 | 92.07,103.34 89.53,105.88 IC22.4 | v111.12,163.03 106.68,163.03 105.41,164.3 102.23,164.3 100.33,166.21 67.94,166.21 66.67,167.47 D34L.32 | v111.12,114.13 110.48,113.5 v102.87,113.5
!BADDAC  (via drill 0.61)
  Top 0.254: v109.22,170.02 118.74,160.49 IC11.1 | v68.58,172.56 68.58,179.54 C36L.34
  Bottom 0.254: v109.22,170.02 107.95,171.28 69.84,171.28 v68.58,172.56
!BBREAK  (via drill 0.61)
  Top 0.254: v99.06,25.23 94.61,29.68 94.61,62.7 93.98,63.34 93.98,73.49 95.88,75.4 IC21.15 | v67.31,127.47 66.67,128.11 66.67,140.81 67.31,141.44 67.31,146.52 66.67,147.16 66.67,161.76 64.77,163.67 64.77,178.27 66.04,179.54 C36L.32 | v80.01,77.3 79.37,77.94 79.37,107.78 78.73,108.42 78.73,123.02 DMA8-11.5
  Bottom 0.254: IC41.1 11.42,76.03 13.96,78.57 16.51,78.57 IC41.15 19.05,78.57 21.59,76.03 73.66,76.03 74.93,77.3 v80.01,77.3 93.98,77.3 95.25,76.03 IC21.15 | v99.06,25.23 104.14,25.23 106.04,23.33 IC20.19 | 80.64,126.2 83.81,129.38 101.59,129.38 102.87,128.11 107.95,128.11 110.48,130.65 127,130.65 128.27,131.92 130.81,131.92 IC6.1 | 80.64,126.2 79.37,124.93 DMA8-11.5 | v67.31,127.47 74.29,127.47 75.56,126.2 80.64,126.2
!BRK_RQ  (via drill 0.61)
  Top 0.254: v60.95,176.37 60.95,179.54 C36L.28
  Bottom 0.254: v60.95,176.37 94.61,176.37 97.15,173.83 107.95,173.83 108.58,173.19 117.47,173.19 118.11,172.56 IC11.6
!BWCO  (via drill 0.61)
  Top 0.254: v123.19,138.27 123.82,138.9 123.82,164.3 v123.19,164.94 | v252.72,124.93 252.72,93.81 254,92.54 IC44.9 | v250.82,88.1 v168.91,6.18
  Bottom 0.254: 124.45,138.27 125.73,137 IC10.13 | v123.19,138.27 124.45,138.27 | v123.19,164.94 125.73,164.94 IC11.12 | v252.72,124.93 239.39,138.27 124.45,138.27 | v168.91,6.18 70.48,6.18 69.21,7.46 C35L.32 | v250.82,88.1 253.36,90.64 IC44.9
!DA00
  Top 0.254: C36L.2 27.94,179.54 27.94,178.27 J14.1
!DA01
  Top 0.254: C36L.4 30.48,179.54 30.48,178.27 J13.1
!DA02
  Top 0.254: C36L.6 33.02,179.54 33.02,178.27 J12.1
!DA03
  Top 0.254: C36L.8 35.55,179.54 35.55,178.27 J11.1
!DA04
  Top 0.254: C36L.10 38.09,179.54 38.09,178.27 J10.1
!DA05
  Top 0.254: C36L.12 40.63,179.54 40.63,178.27 J9.1
!DA06
  Top 0.254: C36L.14 43.17,179.54 43.17,178.27 J8.1
!DA07
  Top 0.254: C36L.16 45.71,179.54 45.71,178.27 J7.1
!DA08
  Top 0.254: C36L.18 48.25,179.54 48.25,178.27 J6.1
!DA09
  Top 0.254: C36L.22 53.34,179.54 53.34,178.27 J5.1
!DA10
  Top 0.254: C36L.24 55.88,179.54 55.88,178.27 J4.1
!DA11
  Top 0.254: C36L.26 58.41,179.54 58.41,178.27 J3.1
!DATA00
  Top 0.254: IC34.12 27.94,21.43 29.21,20.16 29.21,9.36 30.48,8.09 C35L.2
!DATA01
  Top 0.254: IC34.14 33.02,21.43 32.38,20.79 32.38,16.98 31.75,16.35 31.75,9.36 33.02,8.09 C35L.4
!DATA02
  Top 0.254: IC34.16 38.09,21.43 38.09,17.62 36.82,16.35 36.82,9.36 35.55,8.09 C35L.6
!DATA03
  Top 0.254: IC34.18 43.17,21.43 42.54,20.79 42.54,16.98 41.9,16.35 41.9,13.17 39.36,10.63 39.36,9.36 38.09,8.09 C35L.8
!DATA04  (via drill 0.61)
  Top 0.254: v72.39,8.73 72.39,12.54 73.66,13.81 IC26.3
  Bottom 0.254: v72.39,8.73 67.94,8.73 67.31,8.09 67.31,6.18 42.54,6.18 41.27,7.46 C35L.10
!DATA05  (via drill 0.61)
  Top 0.254: v67.31,4.92 67.31,12.54 68.58,13.81 IC26.5
  Bottom 0.254: v67.31,4.92 66.04,3.65 42.54,3.65 39.36,6.82 39.36,8.73 41.27,8.73 42.54,7.46 C35L.12
!DATA06
  Top 0.254: IC26.7 63.49,13.81 62.22,12.54 62.22,6.82 59.05,3.65 45.71,3.65 45.71,6.82 C35L.14
!DATA07  (via drill 0.61)
  Top 0.254: v50.79,14.44 49.52,13.17 49.52,9.36 48.25,8.09 C35L.16
  Bottom 0.254: v50.79,14.44 53.34,16.98 56.51,16.98 57.78,15.71 IC26.9
!DATA08  (via drill 0.61)
  Top 0.254: v58.41,17.62 58.41,21.43 IC26.12 | v52.7,17.62 52.06,16.98 52.06,9.36 50.79,8.09 C35L.18
  Bottom 0.254: v52.7,17.62 v58.41,17.62
!DATA09  (via drill 0.61)
  Top 0.254: v57.14,20.79 57.14,9.36 55.88,8.09 C35L.22
  Bottom 0.254: v57.14,20.79 61.59,20.79 62.86,22.06 IC26.14
!DATA10  (via drill 0.61)
  Top 0.254: v62.22,24.6 62.22,13.81 59.68,11.27 59.68,9.36 58.41,8.09 C35L.24
  Bottom 0.254: v62.22,24.6 66.67,24.6 67.94,23.33 IC26.16
!DATA11  (via drill 0.61)
  Top 0.254: v64.77,8.73 v64.77,20.79
  Bottom 0.254: v64.77,20.79 71.75,20.79 73.02,22.06 IC26.18 | v64.77,8.73 62.86,8.73 61.59,7.46 C35L.26
!DCXA
  Top 0.254: IC16.12 111.12,104.61 109.85,105.88 109.85,152.87 111.12,154.14 IC18.10 111.12,155.41 111.12,156.68 IC18.9
!DIMA  (via drill 0.61)
  Top 0.254: IC30.1 66.04,189.06 64.77,190.34 64.77,192.88 63.49,194.15 IC30.19 63.49,196.69 63.49,210.66 v66.04,213.2 | v107.95,139.53 v107.95,135.72 | v122.55,145.89 121.92,146.52 121.92,187.8 115.56,194.15 115.56,201.13 v104.14,212.56
  Bottom 0.254: IC37.1 36.19,187.16 37.46,185.89 64.13,185.89 65.4,187.16 IC30.1 | v107.95,135.72 111.12,132.55 IC17.11 | v107.95,139.53 111.76,143.34 115.56,143.34 118.11,145.89 v122.55,145.89 | v104.14,212.56 100.33,212.56 99.69,213.2 v66.04,213.2
!DIML  (via drill 0.61)
  Top 0.254: v81.28,181.45 82.55,182.72 82.55,192.88 81.28,194.15 FIELD.11 | v143.5,127.47 144.14,128.11 v144.14,180.81
  Bottom 0.254: INTENB.11 23.49,178.27 26.67,181.45 v81.28,181.45 143.5,181.45 v144.14,180.81 | v143.5,127.47 114.93,127.47 113.03,129.38 IC17.12
!DMA-IN  (via drill 0.61)
  Top 0.254: IC26.1 78.73,16.35 78.73,18.89 76.2,21.43 IC26.19 76.2,23.96 72.39,27.78 v72.39,37.94 | IC41.12 18.41,85.56 19.68,84.29 19.68,16.35 29.84,6.18 44.45,6.18 44.45,10.63 45.08,11.27 48.25,11.27 48.25,13.81 IC34.1
  Bottom 0.254: IC34.1 48.89,14.44 50.16,13.17 76.83,13.17 78.1,14.44 IC26.1 | v72.39,37.94 102.87,37.94 IC13.4
!DMA-OUT
  Top 0.254: IC35.1 45.71,72.22 43.17,74.77 43.17,77.3 IC35.19
  Bottom 0.254: IC28.19 70.48,77.94 69.21,76.67 45.08,76.67 43.81,77.94 IC35.19 42.54,79.21 41.27,80.48 22.86,80.48 22.86,88.73 18.41,93.18 IC41.9 | IC28.1 73.02,70.32 71.75,69.05 47.62,69.05 46.35,70.32 IC35.1
!DRV01  (via drill 0.61)
  Top 0.254: v18.41,38.57 13.33,43.65 13.33,80.48 10.79,83.02 IC41.4
  Bottom 0.254: v18.41,38.57 19.05,39.2 26.03,39.2 32.38,32.86 RS08.38
!DRV23  (via drill 0.61)
  Top 0.254: v14.6,66.51 14.6,86.83 10.79,90.64 IC41.7 | v50.79,62.06 53.34,59.52 53.34,33.49 RS08.22
  Bottom 0.254: v14.6,66.51 19.05,62.06 v50.79,62.06
!DRVOK  (via drill 0.61)
  Top 0.254: IC21.13 95.88,80.48 95.88,79.21 IC21.14 97.15,77.94 98.42,76.67 98.42,56.35 97.15,55.08 v97.15,45.55 | v30.48,43.65 30.48,33.49 RS08.40
  Bottom 0.254: R2.1 25.39,37.3 29.84,32.86 RS08.40 | v97.15,45.55 93.98,42.38 48.89,42.38 48.25,43.02 31.11,43.02 v30.48,43.65
!EXAD0
  Top 0.254: IC20.9 88.9,13.81 84.45,9.36 84.45,6.82 83.18,5.55 71.12,5.55 71.12,6.82 C35L.34
!EXAD1
  Top 0.254: IC20.7 93.34,15.71 92.07,16.98 83.81,16.98 83.81,7.46 82.55,6.18 73.66,6.18 73.66,6.82 C35L.36
!EXAD2
  Bottom 0.254: IC20.5 98.42,14.44 92.7,8.73 78.1,8.73 76.83,7.46 C35L.38
!INT_RQ  (via drill 0.61)
  Top 0.254: IC40.6 12.69,140.81 10.15,143.34 10.15,145.89 IC40.8 | v64.77,162.4 64.13,163.03 64.13,166.21 63.49,166.84 D34L.30 | v35.55,143.98 v35.55,164.3
  Bottom 0.254: IC40.3 19.68,138.9 18.41,137.63 14.6,137.63 13.33,138.9 IC40.6 | v64.77,162.4 46.98,162.4 45.08,164.3 v35.55,164.3 | v35.55,143.98 34.92,144.62 12.69,144.62 10.79,146.52 IC40.8
!IOS  (via drill 0.61)
  Top 0.254: v101.59,109.05 102.87,110.32 106.68,110.32 v106.68,109.05 | v143.5,106.52 144.78,107.78 144.78,152.24 v145.41,152.87 | v120.65,152.24 114.3,158.59 114.3,163.67 v109.22,168.75
  Bottom 0.254: v101.59,109.05 97.79,109.05 IC22.10 | v106.68,109.05 107.95,107.78 128.27,107.78 129.53,106.52 v143.5,106.52 | v145.41,152.87 144.78,152.24 v120.65,152.24 | v109.22,168.75 62.86,168.75 61.59,167.47 D34L.28
!MYDEV
  Top 0.254: IC32.4 42.54,99.53 38.09,103.97 38.09,108.42 PAD1.1
  Bottom 0.254: IC25.4 67.31,98.89 66.04,97.62 58.41,97.62 57.14,98.89 IC29.4 54.6,98.89 53.34,98.89 52.06,97.62 45.71,97.62 44.45,98.89 IC32.4
!NXD  (via drill 0.61)
  Top 0.254: v30.48,118.58 31.75,119.85 v31.75,137 | v3.81,142.71 5.08,143.98 5.08,173.19 4.44,173.83 4.44,190.97 v22.22,208.75 | v104.14,208.75 114.3,198.59 114.3,196.69 IC12.12
  Bottom 0.254: v30.48,118.58 15.87,118.58 11.42,114.13 IC23.6 | v31.75,137 24.76,143.98 5.71,143.98 4.44,145.25 3.81,145.25 2.54,143.98 2.54,142.71 v3.81,142.71 | v104.14,208.75 v22.22,208.75
!PER  (via drill 0.61)
  Top 0.254: v127,183.99 134.62,176.37 v134.62,130.65 | v127.63,130.01 127.63,124.93 IC9.8
  Bottom 0.254: v127,183.99 115.56,183.99 112.39,187.16 IC12.4 | v134.62,130.65 133.98,130.01 v127.63,130.01
!SETNXD  (via drill 0.61)
  Top 0.254: v99.06,55.72 99.06,88.73 97.15,90.64 IC21.9
  Bottom 0.254: v99.06,55.72 98.42,56.35 58.41,56.35 57.78,55.72 6.98,55.72 6.98,105.88 9.52,108.42 IC23.4
!SETPER  (via drill 0.61)
  Top 0.254: v102.23,49.37 102.23,42.38 103.5,41.11 IC13.5 | v121.28,49.37 121.28,117.94 v122.55,119.21
  Bottom 0.254: v102.23,49.37 v121.28,49.37 | v122.55,119.21 125.73,119.21 IC9.10
!SETWLS  (via drill 0.61)
  Top 0.254: v130.17,120.48 129.53,121.12 129.53,144.62 131.44,146.52 IC6.7
  Bottom 0.254: v130.17,120.48 117.47,120.48 117.47,118.58 118.74,117.31 IC9.4
!SKIP  (via drill 0.61)
  Top 0.254: 97.15,168.11 97.15,166.21 96.52,165.57 R1.1 96.52,164.3 96.52,124.93 v97.15,124.29 | 97.15,168.11 98.42,169.38 IC19.2 | 97.15,168.11 97.15,178.27 98.42,179.54 IC19.6
  Bottom 0.254: IC19.10 105.41,177.64 102.87,180.18 100.33,180.18 IC19.6 | v97.15,124.29 100.33,124.29 102.87,121.75 IC17.2
!START  (via drill 0.61)
  Top 0.254: v102.87,141.44 102.23,142.08 102.23,147.79 103.5,149.06 IC18.3
  Bottom 0.254: 43.81,133.82 17.14,133.82 15.87,132.55 DMA0-3.11 | 43.81,133.82 45.08,132.55 DMA4-7.11 | 74.29,133.82 75.56,132.55 DMA8-11.11 | 74.29,133.82 43.81,133.82 | v102.87,141.44 94.61,133.19 90.17,133.19 89.53,133.82 74.29,133.82
!WE  (via drill 0.61)
  Top 0.254: v113.66,110.32 114.3,110.96 v114.3,139.53 | v75.56,52.54 71.12,48.09 71.12,33.49 RS08.8 | v78.1,52.54 81.91,56.35 81.91,82.38 80.64,83.65 v80.64,109.05
  Bottom 0.254: v113.66,110.32 91.44,110.32 90.17,109.05 IC22.5 87.62,109.05 v80.64,109.05 | v114.3,139.53 118.11,143.34 129.53,143.34 130.81,142.08 IC6.5 | v78.1,52.54 v75.56,52.54
!WLS
  Top 0.254: IC9.6 120.01,122.39 122.55,124.93 122.55,136.36 124.45,138.27 124.45,167.47 122.55,169.38 122.55,188.43 116.84,194.15 IC12.13
BAC00  (via drill 0.61)
  Top 0.254: v17.78,129.38 21.59,125.56 v21.59,114.13
  Bottom 0.254: v17.78,129.38 12.69,129.38 10.79,131.28 DMA0-3.9 | v21.59,114.13 24.76,114.13 D36L.2
BAC01  (via drill 0.61)
  Top 0.254: v14.6,114.13 13.33,115.4 13.33,116.04 13.96,116.67 13.96,129.38 12.69,130.65 DMA0-3.10
  Bottom 0.254: v14.6,114.13 15.87,115.4 26.03,115.4 27.3,114.13 D36L.4
BAC02
  Top 0.254: DMA0-3.1 27.94,123.02 29.21,121.75 29.21,116.04 30.48,114.77 D36L.6
BAC03  (via drill 0.61)
  Top 0.254: 26.67,129.38 25.39,130.65 DMA0-3.15 | 26.67,129.38 26.67,113.5 27.3,112.86 32.38,112.86 32.38,114.13 D36L.8 | v26.03,163.67 26.03,177 23.49,179.54 INTENB.10 | v29.84,163.67 29.21,163.03 29.21,149.06 26.67,146.52 26.67,129.38
  Bottom 0.254: v29.84,163.67 v26.03,163.67
BAC04  (via drill 0.61)
  Top 0.254: DMA4-7.9 40.63,133.19 39.36,134.46 39.36,142.71 40.63,143.98 40.63,145.89 DAR4-7.9 | v16.51,149.06 16.51,163.67 15.87,164.3 INTENB.1 | v36.82,131.28 36.82,116.04 35.55,114.77 D36L.10
  Bottom 0.254: v16.51,149.06 38.73,149.06 40,147.79 DAR4-7.9 | v36.82,131.28 40,131.28 DMA4-7.9
BAC05  (via drill 0.61)
  Top 0.254: v24.12,154.14 24.12,161.12 24.76,161.76 24.76,165.57 23.49,166.84 INTENB.15 | v45.71,154.78 44.45,153.5 44.45,149.7 43.17,148.43 DAR4-7.10 43.17,145.89 43.17,144.62 41.9,143.34 41.9,134.46 43.17,133.19 DMA4-7.10 43.17,130.65 43.17,129.38 39.36,125.56 39.36,116.04 38.09,114.77 D36L.12
  Bottom 0.254: v24.12,154.14 24.76,154.78 v45.71,154.78
BAC06  (via drill 0.61)
  Top 0.254: DMA4-7.1 58.41,125.56 57.14,126.83 57.14,133.19 58.41,134.46 58.41,138.27 DAR4-7.1 | v77.47,143.34 77.47,192.88 78.73,194.15 FIELD.10
  Bottom 0.254: v77.47,143.34 66.04,143.34 62.86,140.17 59.05,140.17 DAR4-7.1 | D36L.14 40,114.13 38.73,115.4 32.38,115.4 31.75,116.04 31.75,119.21 49.52,119.21 52.06,121.75 55.88,121.75 57.78,123.66 DMA4-7.1
BAC07  (via drill 0.61)
  Top 0.254: DMA4-7.15 55.88,133.19 57.14,134.46 v57.14,135.72 57.14,142.71 55.88,143.98 55.88,145.89 DAR4-7.15 | v94.61,135.72 95.88,137 95.88,161.76 94.61,163.03 94.61,185.89 93.98,186.53 FIELD.1 | v50.79,135.72 49.52,134.46 49.52,123.02 44.45,117.94 44.45,116.04 43.17,114.77 D36L.16
  Bottom 0.254: v94.61,135.72 82.55,135.72 81.91,135.09 57.78,135.09 v57.14,135.72 v50.79,135.72
BAC08  (via drill 0.61)
  Top 0.254: DMA8-11.9 71.12,133.19 72.39,134.46 v72.39,136.36 72.39,144.62 71.12,145.89 DAR8-11.9 | v94.61,137 95.25,137.63 95.25,161.12 93.98,162.4 93.98,178.27 92.7,179.54 92.7,192.88 91.44,194.15 FIELD.15 | v64.77,117.94 62.86,119.85 v62.86,131.92
  Bottom 0.254: v94.61,137 93.98,136.36 81.91,136.36 81.28,135.72 73.02,135.72 v72.39,136.36 | v64.77,117.94 54.6,117.94 54.6,116.04 53.97,115.4 47.62,115.4 46.35,114.13 D36L.18 | v62.86,131.92 70.48,131.92 DMA8-11.9
BAC09  (via drill 0.61)
  Top 0.254: DAR8-11.10 73.66,145.89 73.66,142.08 74.93,140.81 74.93,134.46 73.66,133.19 DMA8-11.10 73.66,130.65 72.39,129.38 v72.39,121.12 | v52.06,120.48 52.06,116.04 50.79,114.77 D36L.22
  Bottom 0.254: v52.06,120.48 52.7,121.12 v72.39,121.12
BAC10  (via drill 0.61)
  Top 0.254: DAR8-11.1 88.9,138.27 88.9,134.46 87.62,133.19 87.62,130.65 88.26,130.01 88.26,126.2 88.9,125.56 DMA8-11.1 88.9,123.02 88.9,116.67 v86.36,114.13
  Bottom 0.254: v86.36,114.13 75.56,114.13 74.29,112.86 70.48,112.86 69.84,113.5 69.84,114.77 69.21,115.4 55.24,115.4 53.97,114.13 D36L.24
BAC11  (via drill 0.61)
  Top 0.254: DAR8-11.15 86.36,145.89 86.36,144.62 87.62,143.34 87.62,134.46 86.36,133.19 DMA8-11.15 86.36,130.65 87.62,129.38 87.62,122.39 v85.09,119.85 | v57.14,119.21 57.14,116.04 55.88,114.77 D36L.26
  Bottom 0.254: v57.14,119.21 58.41,120.48 71.75,120.48 72.39,119.85 v85.09,119.85
BINIT  (via drill 0.61)
  Top 0.254: IC9.11 126.36,117.31 125.09,118.58 125.09,140.17 126.36,141.44 IC10.11 | v71.12,110.32 71.12,113.5 D36L.38
  Bottom 0.254: IC9.11 125.73,116.67 123.19,116.67 120.65,114.13 IC9.3 118.11,114.13 116.84,115.4 73.02,115.4 71.75,114.13 D36L.38 | IC10.3 120.65,139.53 123.19,142.08 125.73,142.08 IC10.11 | v71.12,110.32 15.23,110.32 11.42,106.52 IC23.3
BIOP1  (via drill 0.61)
  Top 0.254: v40.63,111.59 40.63,106.52 42.54,104.61 IC32.6
  Bottom 0.254: v40.63,111.59 41.9,112.86 56.51,112.86 57.78,114.13 D36L.28
BIOP2  (via drill 0.61)
  Top 0.254: v53.34,111.59 53.34,106.52 55.24,104.61 IC29.6
  Bottom 0.254: v53.34,111.59 53.97,112.23 58.41,112.23 60.32,114.13 D36L.30
BIOP4
  Top 0.254: IC25.6 67.94,104.61 65.4,107.15 65.4,111.59 63.49,113.5 D36L.32
BMB00
  Top 0.254: IC35.8 27.94,72.22 26.67,73.49 26.67,79.84 25.39,81.11 25.39,83.02 D35L.2
BMB01
  Top 0.254: IC35.6 33.02,72.22 32.38,72.86 32.38,76.67 31.75,77.3 31.75,79.84 28.57,83.02 28.57,83.65 D35L.4
BMB02
  Top 0.254: IC35.4 38.09,72.22 36.82,73.49 36.82,79.84 34.28,82.38 30.48,82.38 30.48,83.02 D35L.6
BMB03
  Top 0.254: IC35.2 43.17,72.22 41.9,73.49 41.9,79.84 39.36,82.38 35.55,82.38 35.55,83.02 D35L.10
  Bottom 0.254: IC36.3 24.76,95.72 23.49,94.45 23.49,84.92 33.65,84.92 34.92,83.65 D35L.10
BMB04  (via drill 0.61)
  Top 0.254: v36.82,89.37 39.36,86.83 39.36,85.56 40.63,84.29 D35L.14 | v67.31,84.92 67.31,81.11 66.04,79.84 IC28.17
  Bottom 0.254: v36.82,89.37 31.11,89.37 26.67,93.81 IC36.2 | v67.31,84.92 42.54,84.92 41.27,83.65 D35L.14
BMB05  (via drill 0.61)
  Top 0.254: v43.17,88.1 44.45,86.83 44.45,85.56 45.71,84.29 D35L.18 | v62.22,87.46 62.22,81.11 60.95,79.84 IC28.15
  Bottom 0.254: IC36.1 26.67,91.27 29.84,88.1 v43.17,88.1 61.59,88.1 v62.22,87.46
BMB06
  Top 0.254: IC28.13 55.88,79.84 53.34,82.38 53.34,83.02 D35L.24 53.34,84.29 54.6,85.56 54.6,90 53.97,90.64 53.97,94.45 55.24,95.72 IC29.3
  Bottom 0.254: 53.34,95.08 45.71,95.08 44.45,96.35 IC32.3 | 53.34,95.08 54.6,96.35 IC29.3 | 53.34,95.08 66.04,95.08 67.31,96.35 IC25.3
BMB07  (via drill 0.61)
  Top 0.254: IC28.11 50.79,79.84 52.06,81.11 v52.06,82.38 52.06,90 52.7,90.64 v52.7,92.54
  Bottom 0.254: v52.06,82.38 56.51,82.38 57.78,83.65 D35L.28 | IC32.2 44.45,93.81 45.08,93.18 48.89,93.18 49.52,92.54 v52.7,92.54 53.34,92.54 54.6,93.81 IC29.2 57.14,93.81 58.41,92.54 66.04,92.54 67.31,93.81 IC25.2
BMB08
  Top 0.254: IC28.8 55.88,72.22 57.14,73.49 57.14,91.27 IC29.1 | D35L.32 63.49,84.29 64.77,85.56 64.77,87.46 67.94,90.64 IC25.1
  Bottom 0.254: 53.34,90 45.71,90 44.45,91.27 IC32.1 | 53.34,90 54.6,91.27 IC29.1 | 53.34,90 66.04,90 67.31,91.27 IC25.1
BMB09
  Top 0.254: IC28.6 60.95,72.22 62.22,73.49 62.22,79.84 65.4,83.02 65.4,83.65 D35L.34 | IC17.3 105.41,124.29 107.31,124.29 107.31,119.21 108.58,117.94 108.58,94.45 110.48,92.54 113.66,92.54 113.66,96.99 112.39,98.26 IC16.14
  Bottom 0.254: IC16.14 112.39,98.26 113.66,96.99 113.66,90 86.36,90 78.73,82.38 67.94,82.38 66.67,83.65 D35L.34
BMB10  (via drill 0.61)
  Top 0.254: IC28.4 66.04,72.22 67.31,73.49 67.31,79.84 68.58,81.11 68.58,83.02 D35L.36 | v106.04,123.02 106.04,119.21 107.95,117.31 107.95,100.16 104.77,96.99 IC16.2 | v84.45,89.37 v84.45,96.35
  Bottom 0.254: v106.04,123.02 107.31,124.29 110.48,124.29 IC17.14 | v84.45,89.37 80.01,84.92 70.48,84.92 69.21,83.65 D35L.36 | v84.45,96.35 85.09,96.99 103.5,96.99 IC16.2
BMB11
  Top 0.254: IC28.2 71.12,72.22 70.48,72.86 70.48,76.67 69.84,77.3 69.84,81.75 71.12,83.02 D35L.38
BRK_RQ  (via drill 0.61)
  Top 0.254: v120.65,177.64 121.28,177 121.28,171.92 120.01,170.65 IC11.5 | v194.31,180.81 196.84,178.27 196.84,114.77 204.47,107.15 204.47,93.81 205.74,92.54 IC42.13
  Bottom 0.254: v120.65,177.64 122.55,179.54 148.59,179.54 149.86,180.81 v194.31,180.81
BTS1  (via drill 0.61)
  Top 0.254: v129.53,161.12 130.17,160.49 130.17,149.06 130.81,148.43 133.98,148.43 133.98,131.28 131.44,128.74 v131.44,126.2 | v97.15,120.48 94.61,117.94 v94.61,112.86
  Bottom 0.254: v129.53,161.12 117.47,161.12 117.47,163.03 118.74,164.3 IC11.3 | v131.44,126.2 116.2,126.2 113.03,123.02 107.95,123.02 105.41,120.48 v97.15,120.48 | v94.61,112.86 75.56,112.86 74.93,112.23 69.84,112.23 68.58,113.5 D36L.36
BUSY
  Bottom 0.254: IC10.9 128.27,147.16 129.53,148.43 142.24,148.43 154.3,160.49 154.3,161.76 140.33,161.76 IC7.14 138.43,162.4 137.16,163.67 121.92,163.67 120.65,162.4 IC11.2
BWCO
  Bottom 0.254: IC44.8 257.17,90.64 258.44,89.37 290.19,89.37 291.46,90.64 IC46.9
CIE  (via drill 0.61)
  Top 0.254: v71.12,196.05 71.12,218.91 | 71.12,218.91 71.12,220.18 | IC33.9 177.8,92.54 176.53,93.81 176.53,141.44 186.69,151.6 186.69,211.29 179.06,218.91 71.12,218.91 | v17.14,142.71 13.96,145.89 13.96,163.67 13.33,164.3 13.33,168.11 14.6,169.38 INTENB.3
  Bottom 0.254: v71.12,196.05 68.58,193.51 55.24,193.51 | 55.24,193.51 53.97,194.78 IC30.15 | 55.24,193.51 4.44,193.51 4.44,173.83 5.71,172.56 11.42,172.56 13.96,170.02 INTENB.3 | v17.14,142.71 22.22,142.71 24.76,140.17 IC40.1
DAR04  (via drill 0.61)
  Top 0.254: v76.83,78.57 75.56,77.3 v75.56,70.32 | v12.06,74.77 12.06,76.67 10.79,77.94 IC41.2 9.52,79.21 9.52,80.48 IC41.3 9.52,81.75 8.25,83.02 8.25,120.48 v8.88,121.12 | 44.45,142.08 43.17,140.81 DAR4-7.7 | v44.45,145.25 44.45,142.08 | v57.14,143.98 57.14,154.78 55.88,156.05 55.88,158.59 IC31.17 | v67.31,162.4 67.31,221.45 177.8,221.45 185.41,213.83 202.56,213.83 IC39.1 | v43.17,128.11 44.45,129.38 44.45,142.08
  Bottom 0.254: v76.83,78.57 87.62,78.57 IC21.3 | v75.56,70.32 73.66,68.41 18.41,68.41 v12.06,74.77 | v44.45,145.25 45.08,144.62 56.51,144.62 v57.14,143.98 | v67.31,162.4 66.04,161.12 64.77,161.12 64.13,161.76 57.78,161.76 56.51,160.49 IC31.17 | v8.88,121.12 7.62,122.39 7.62,128.11 v43.17,128.11
DAR05  (via drill 0.61)
  Top 0.254: v86.36,30.32 90.8,34.76 90.8,74.13 89.53,75.4 IC21.2 | DAR4-7.6 46.35,140.17 49.52,143.34 49.52,157.31 50.79,158.59 IC31.15 50.16,160.49 v45.71,164.94 | v77.47,40.48 77.47,32.22 78.73,30.95 RS08.1 | v14.6,41.11 6.98,48.73 6.98,136.36 2.54,140.81 v2.54,153.5 | v203.19,218.28 207.64,213.83 IC39.3
  Bottom 0.254: v86.36,30.32 79.37,30.32 RS08.1 | 2.54,168.75 2.54,199.86 20.95,218.28 v203.19,218.28 | 2.54,168.75 17.78,168.75 20.32,166.21 31.11,166.21 31.75,166.84 31.75,168.75 41.27,168.75 41.9,168.11 41.9,164.94 v45.71,164.94 | v77.47,40.48 76.83,41.11 v14.6,41.11 | v2.54,153.5 1.27,154.78 1.27,168.75 2.54,168.75
DAR06  (via drill 0.61)
  Top 0.254: v80.01,74.13 79.37,73.49 79.37,55.08 73.66,49.37 73.66,33.49 RS08.6 | v47.62,142.71 46.98,143.34 46.98,157.31 45.71,158.59 IC31.13 | 69.84,220.81 v69.84,219.55 v69.84,162.4 | v65.4,159.22 64.77,158.59 v64.77,143.34 62.86,141.44 62.86,137 64.13,135.72 64.13,131.92 63.49,131.28 63.49,121.75 v66.04,119.21 | v85.09,110.32 85.72,109.69 85.72,76.67 88.26,74.13 IC21.1 | v81.28,111.59 80.01,112.86 v80.01,116.67 | v207,219.55 212.72,213.83 IC39.5
  Bottom 0.254: v80.01,74.13 86.99,74.13 87.62,73.49 IC21.1 | 53.97,141.44 52.7,142.71 v47.62,142.71 | 53.97,141.44 55.24,140.17 DAR4-7.2 | v69.84,162.4 66.67,159.22 v65.4,159.22 | v64.77,143.34 62.86,141.44 53.97,141.44 | v85.09,110.32 83.81,111.59 v81.28,111.59 | v80.01,116.67 79.37,117.31 74.93,117.31 73.02,119.21 v66.04,119.21 | v69.84,219.55 v207,219.55
DAR07  (via drill 0.61)
  Top 0.254: v53.34,143.34 53.34,140.81 DAR4-7.3 | v39.36,143.98 39.36,157.31 40.63,158.59 IC31.11 40.63,161.12 41.9,162.4 41.9,195.42 v41.27,196.05 | 137.79,51.27 137.79,29.68 139.06,28.41 IC1.9 | 137.79,51.27 139.06,52.54 IC2.9 | 137.79,76.67 139.06,77.94 IC3.9 | 137.79,76.67 137.79,51.27 | 137.79,76.67 137.79,102.07 139.06,103.34 IC4.9 140.33,104.61 141.6,105.88 141.6,217 100.33,217 v81.91,198.59 | v222.25,79.84 222.25,109.69 222.88,110.32 224.15,110.32 225.42,111.59 225.42,193.51 225.42,196.05 241.3,211.93 IC43.1 | v78.73,27.78 78.73,28.41 76.83,30.32 RS08.3
  Bottom 0.254: v53.34,143.34 52.7,143.98 v39.36,143.98 | v222.25,79.84 220.97,78.57 140.97,78.57 IC3.9 | v78.73,27.78 80.01,26.51 123.19,26.51 125.73,29.05 137.16,29.05 138.43,27.78 IC1.9 | v41.27,196.05 43.17,197.96 81.28,197.96 v81.91,198.59
DAR08  (via drill 0.61)
  Top 0.254: v72.39,161.76 72.39,145.89 73.02,145.25 73.02,141.44 73.66,140.81 DAR8-11.7 | 141.6,48.73 141.6,27.14 140.33,25.87 IC1.10 | 141.6,48.73 140.33,50 IC2.10 | 141.6,74.13 140.33,75.4 IC3.10 | 141.6,74.13 141.6,48.73 | 141.6,74.13 141.6,99.53 140.33,100.8 IC4.10 140.33,102.07 142.24,103.97 142.24,155.41 | v142.87,172.56 142.24,171.92 142.24,155.41 | v76.2,36.66 76.2,33.49 RS08.4 | v86.36,155.41 86.36,158.59 IC24.17 | v142.87,155.41 142.24,155.41 | v250.19,182.08 250.19,215.1 248.28,215.1 247.01,213.83 IC43.3
  Bottom 0.254: v72.39,161.76 84.45,161.76 85.72,160.49 IC24.17 | v250.19,182.08 247.65,179.54 149.86,179.54 v142.87,172.56 | v76.2,36.66 123.19,36.66 126.36,33.49 144.14,33.49 145.41,32.22 145.41,25.87 140.33,25.87 IC1.10 | v86.36,155.41 86.99,154.78 97.15,154.78 98.42,156.05 129.53,156.05 130.17,155.41 v142.87,155.41
DAR09  (via drill 0.61)
  Top 0.254: IC1.11 140.33,23.33 142.87,25.87 v142.87,46.83 v142.87,70.32 v142.87,96.99 | v81.28,137 81.28,136.36 79.37,136.36 76.83,138.9 DAR8-11.6 | v98.42,142.08 98.42,153.5 99.06,154.14 v99.06,163.03 | v82.55,163.03 81.28,161.76 81.28,161.12 IC24.15 | v102.87,163.03 v102.87,215.74 | v146.68,102.7 147.31,103.34 147.31,205.58 147.95,206.21 147.95,210.02 | 147.95,210.02 147.95,211.93 v144.78,215.1 | v251.46,210.02 251.46,211.93 IC43.5 | 147.95,210.02 v147.31,210.02
  Bottom 0.254: v142.87,46.83 141.6,48.09 140.97,48.09 IC2.11 | v142.87,70.32 140.33,72.86 IC3.11 | 141.6,98.26 v142.87,96.99 | 141.6,98.26 140.97,98.89 IC4.11 | RS08.5 74.29,30.32 75.56,31.59 99.69,31.59 102.23,29.05 124.45,29.05 125.09,29.68 140.33,29.68 141.6,28.41 141.6,26.51 138.43,26.51 137.79,25.87 137.79,23.33 139.06,23.33 IC1.11 | v81.28,137 81.91,137.63 93.98,137.63 v98.42,142.08 | v82.55,163.03 v99.06,163.03 v102.87,163.03 | v102.87,215.74 144.78,215.74 v144.78,215.1 | 141.6,98.26 146.05,102.7 v146.68,102.7 | v147.31,210.02 v251.46,210.02
DAR10  (via drill 0.61)
  Top 0.254: v78.73,143.34 77.47,142.08 74.93,142.08 74.93,157.31 | 74.93,157.31 76.2,158.59 IC24.13 | v90.17,217 73.02,199.86 73.02,185.25 74.93,183.35 74.93,157.31 | v82.55,7.46 v82.55,34.12
  Bottom 0.254: v78.73,143.34 82.55,143.34 85.72,140.17 DAR8-11.2 | v90.17,217 102.87,217 103.5,216.37 176.53,216.37 176.53,211.93 177.16,211.29 277.49,211.29 278.76,212.56 IC45.1 280.03,212.56 281.3,211.29 311.78,211.29 311.78,102.7 216.53,7.46 v82.55,7.46 | v82.55,34.12 70.48,34.12 69.21,32.86 RS08.10
DAR11  (via drill 0.61)
  Top 0.254: IC24.11 71.12,158.59 69.21,156.68 v69.21,142.08 69.84,141.44 69.84,110.32 72.39,107.78 72.39,50.63 69.84,48.09 69.84,32.22 71.12,30.95 RS08.7 71.12,29.68 71.12,27.78 72.39,26.51 72.39,21.43 v74.29,19.52 | 285.75,147.79 262.88,124.93 262.88,90.64 v181.61,9.36 | 285.75,147.79 290.82,152.87 | 285.75,147.79 285.75,210.66 284.48,211.93 IC45.3
  Bottom 0.254: v69.21,142.08 81.28,142.08 83.18,140.17 DAR8-11.3 | v181.61,9.36 180.97,8.73 125.73,8.73 120.65,13.81 114.3,13.81 108.58,19.52 v74.29,19.52
DATA_IN  (via drill 0.61)
  Top 0.254: v85.09,116.67 v85.09,111.59 | v100.96,116.67 102.23,117.94 102.23,124.93 102.87,125.56 106.04,125.56 v106.04,139.53 | v88.9,143.34 87.62,144.62 87.62,148.43 88.26,149.06 v90.17,149.06 | v107.31,157.31 v107.31,150.97 | v92.07,156.68 92.7,157.31 92.7,178.27 v91.44,179.54
  Bottom 0.254: v85.09,111.59 87.62,111.59 IC22.6 | v100.96,116.67 v85.09,116.67 | v106.04,139.53 102.23,143.34 v88.9,143.34 | v90.17,149.06 90.8,149.7 101.59,149.7 102.87,150.97 v107.31,150.97 | v107.31,157.31 106.04,158.59 102.23,158.59 100.33,156.68 v92.07,156.68 | v91.44,179.54 90.8,178.91 65.4,178.91 64.13,180.18 C36L.30
DIO00  (via drill 0.61)
  Top 0.254: IC34.8 30.48,16.35 31.75,17.62 v31.75,31.59 31.75,44.29 24.12,51.91 24.12,56.98 | 24.12,56.98 24.12,76.03 25.39,77.3 IC35.12 | IC13.12 111.12,36.03 109.85,37.3 109.85,53.81 111.12,55.08 IC14.12 | v154.3,55.08 168.91,69.68 168.91,93.81 165.09,97.62 IC33.1 | v29.21,56.98 24.12,56.98
  Bottom 0.254: v31.75,31.59 33.65,31.59 34.92,32.86 RS08.36 | v154.3,55.08 112.39,55.08 IC14.12 110.48,55.72 109.22,56.98 v29.21,56.98
DIO01  (via drill 0.61)
  Top 0.254: IC34.6 35.55,16.35 34.28,17.62 34.28,28.41 33.02,29.68 RS08.37 | v33.02,39.84 33.02,44.29 31.75,45.55 31.75,76.03 30.48,77.3 IC35.14 | IC13.11 112.39,38.57 113.66,39.84 113.66,56.35 112.39,57.62 IC14.11 | v161.92,96.99 154.3,89.37 v154.3,72.86
  Bottom 0.254: v33.02,39.84 18.41,39.84 17.14,38.57 | 17.14,38.57 17.14,29.05 31.11,29.05 32.38,30.32 RS08.37 | v161.92,96.99 168.27,96.99 169.54,98.26 IC33.3 | v154.3,72.86 140.33,58.89 112.39,58.89 IC14.11 | 17.14,38.57 15.87,39.84 14.6,39.84 13.33,41.11 13.33,42.38 47.62,42.38 48.25,41.74 116.2,41.74 117.47,40.48 117.47,38.57 112.39,38.57 IC13.11
DIO02  (via drill 0.61)
  Top 0.254: v36.82,20.16 36.82,28.41 35.55,29.68 RS08.35 35.55,30.95 34.28,32.22 v34.28,58.26 34.28,76.03 35.55,77.3 IC35.16 | v147.95,100.8 v147.95,65.24
  Bottom 0.254: v36.82,20.16 40.63,16.35 IC34.4 | IC13.10 110.48,40.48 109.22,39.2 66.04,39.2 65.4,39.84 43.17,39.84 36.82,33.49 36.82,30.95 35.55,30.95 RS08.35 | 107.95,59.52 41.9,59.52 40.63,58.26 v34.28,58.26 | 107.95,59.52 109.22,59.52 110.48,60.8 IC14.10 | v147.95,100.8 173.35,100.8 174.62,99.53 IC33.5 | v147.95,65.24 140.97,58.26 114.3,58.26 113.03,56.98 110.48,56.98 107.95,59.52
DIO03  (via drill 0.61)
  Top 0.254: v40.63,20.16 39.36,21.43 39.36,28.41 | 39.36,28.41 38.09,29.68 RS08.33 | 39.36,59.52 39.36,28.41 | 39.36,59.52 39.36,76.03 40.63,77.3 IC35.18 | v108.58,45.55 109.22,46.19 109.22,60.8 111.12,62.7 IC14.9 | v193.03,55.08 193.03,87.46 203.19,97.62 IC42.1 | v40.63,59.52 39.36,59.52
  Bottom 0.254: v40.63,20.16 45.08,15.71 IC34.2 | 110.48,44.29 109.22,45.55 v108.58,45.55 | 110.48,44.29 111.12,43.65 IC13.9 | v193.03,55.08 179.7,41.74 137.79,41.74 133.98,45.55 133.98,46.83 130.81,46.83 128.27,49.37 125.73,49.37 120.65,44.29 110.48,44.29 | v40.63,59.52 41.27,60.16 100.96,60.16 102.87,62.06 109.22,62.06 110.48,63.34 IC14.9
DIO04  (via drill 0.61)
  Top 0.254: v56.51,25.23 52.06,29.68 52.06,30.95 50.79,32.22 RS08.24 | v68.58,74.13 68.58,72.22 IC28.3 68.58,69.68 68.58,35.4 v67.31,34.12 | v207,79.84 207,96.35 208.28,97.62 IC42.3
  Bottom 0.254: v56.51,25.23 57.14,25.87 67.94,25.87 70.48,23.33 IC26.17 | v68.58,74.13 69.21,73.49 79.37,73.49 80.64,72.22 101.59,72.22 102.87,73.49 IC15.2 105.41,73.49 106.68,74.77 113.03,74.77 118.11,79.84 v207,79.84 | v67.31,34.12 52.7,34.12 51.43,32.86 RS08.24
DIO05  (via drill 0.61)
  Top 0.254: v64.77,35.4 64.77,25.23 66.04,23.96 IC26.15 | v109.85,82.38 109.22,81.75 v109.22,73.49 | v61.59,36.03 61.59,67.78 63.49,69.68 IC28.5
  Bottom 0.254: v64.77,35.4 64.13,34.76 61.59,34.76 | 61.59,34.76 50.79,34.76 48.89,32.86 RS08.26 | IC28.5 64.13,71.59 65.4,72.86 78.73,72.86 80.64,70.95 102.87,70.95 IC15.1 105.41,70.95 106.68,72.22 107.95,72.22 v109.22,73.49 | v109.85,82.38 113.03,82.38 113.66,83.02 174.62,83.02 185.41,93.81 208.28,93.81 212.72,98.26 IC42.5 | v61.59,36.03 61.59,34.76
DIO06  (via drill 0.61)
  Top 0.254: v54.6,29.05 59.68,29.05 60.95,27.78 60.95,23.96 IC26.13 | v59.68,36.66 v59.68,66.51 59.68,68.41 58.41,69.68 IC28.7 | v238.12,102.07 240.66,99.53 IC44.1 | v125.09,112.86 123.82,111.59 123.82,79.21 v124.45,78.57